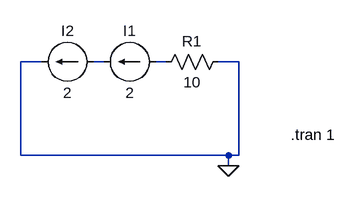
[diagram p0: schematic serialCurrent.asc]
serialCurrent.asc, the LTspice schematic file:
Version 4
SHEET 1 880 680
WIRE 176 128 144 128
WIRE 272 128 256 128
WIRE 368 128 352 128
WIRE 480 128 448 128
WIRE 144 272 144 128
WIRE 464 272 144 272
WIRE 480 272 480 128
WIRE 480 272 464 272
WIRE 464 288 464 272
FLAG 464 288 0
SYMBOL current 256 128 R90
WINDOW 0 -32 40 VBottom 2
WINDOW 3 32 40 VTop 2
WINDOW 123 0 0 Left 2
WINDOW 39 0 0 Left 2
SYMATTR InstName I2
SYMATTR Value 2
SYMBOL res 464 112 R90
WINDOW 0 0 56 VBottom 2
WINDOW 3 32 56 VTop 2
SYMATTR InstName R1
SYMATTR Value 10
SYMBOL current 352 128 R90
WINDOW 0 -32 40 VBottom 2
WINDOW 3 32 40 VTop 2
WINDOW 123 0 0 Left 2
WINDOW 39 0 0 Left 2
SYMATTR InstName I1
SYMATTR Value 2
TEXT 560 240 Left 2 !.tran 1

The netlist it stands for:
* serialCurrent.asc
I2 N001 0 2
R1 0 N002 10
I1 N002 N001 2
.tran 1
.backanno
.end